# EAGLE board MEGA2560_Rev3e (EAGLE 9.3.0)
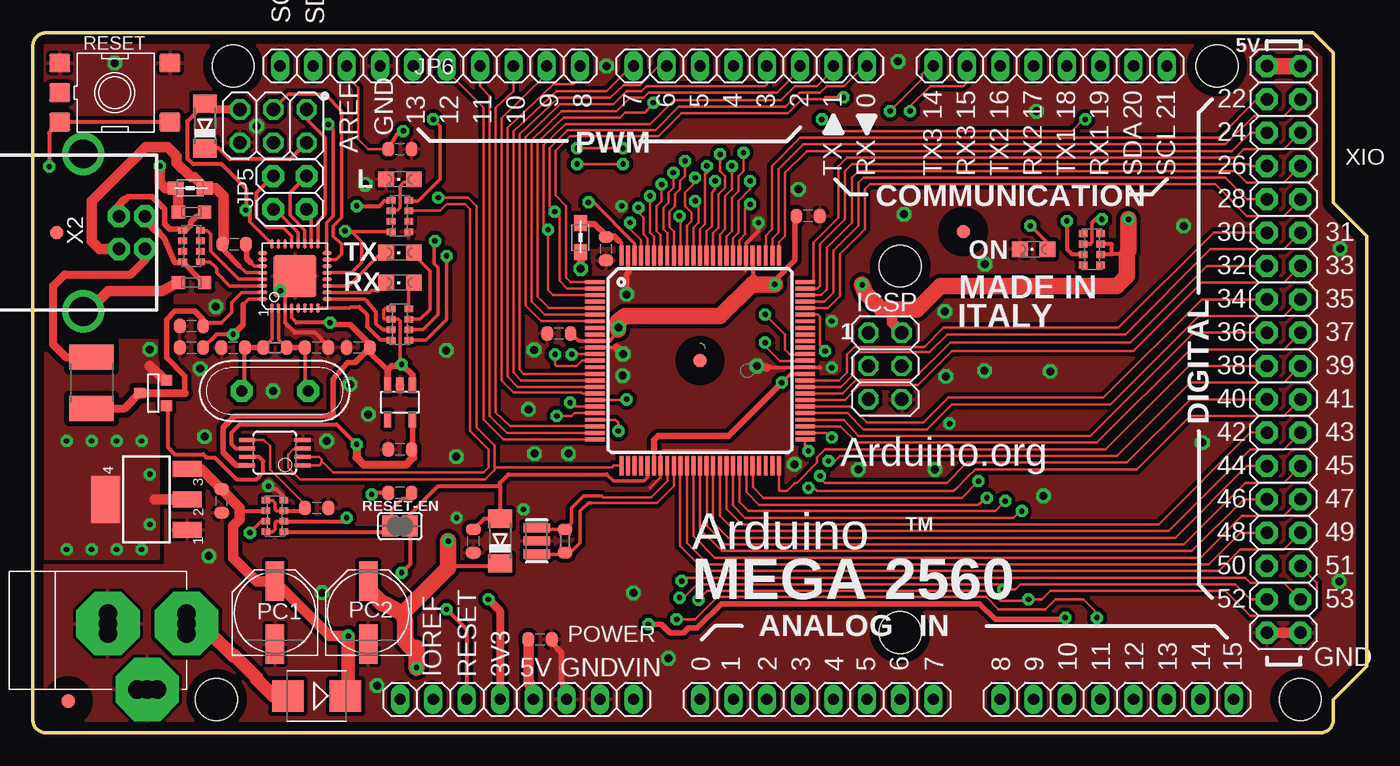
[diagram p2: board, top side]
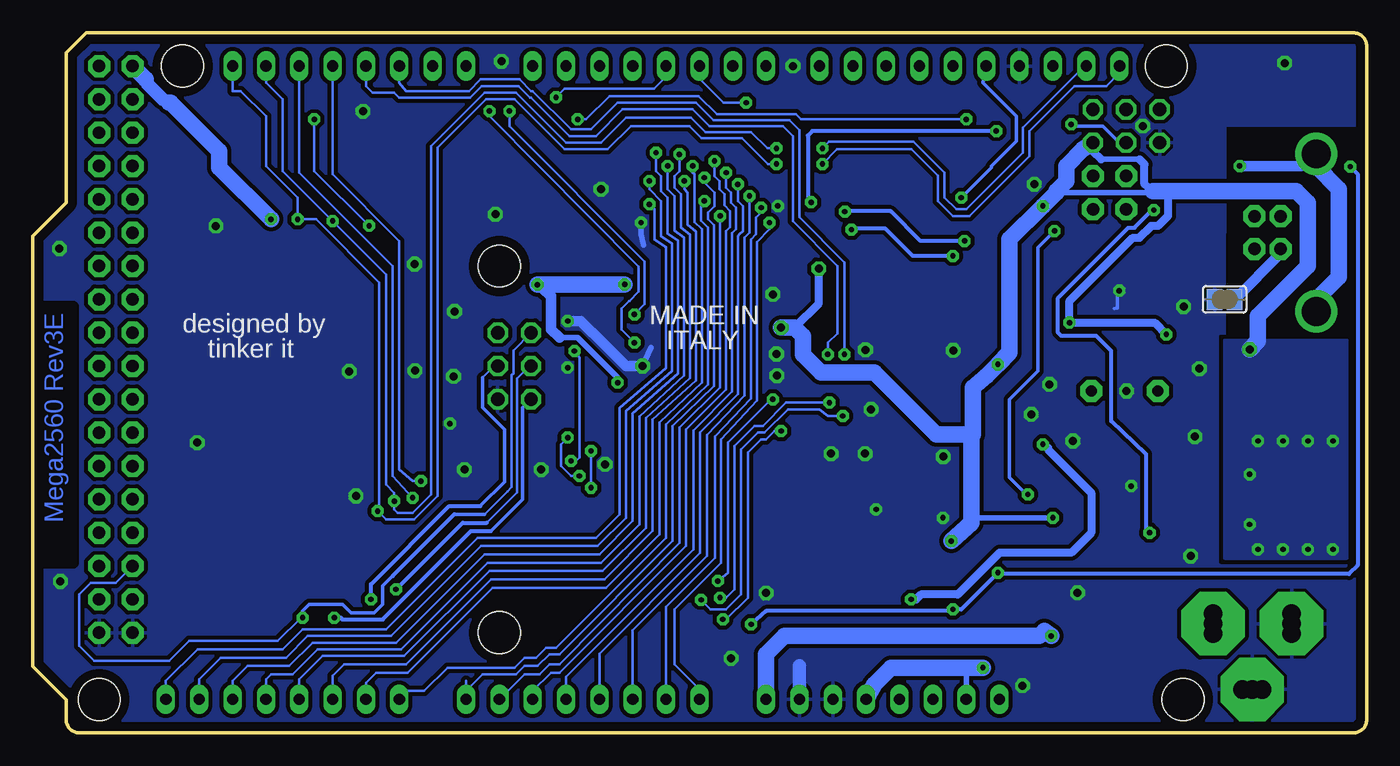
[diagram p3: board, bottom side, seen from below]

Size 101.6 x 53.34 mm. Coordinates in mm from the lower left corner, seen from the top.
Outline: 97.54,53.34 99.06,51.82 99.06,40.39 101.6,37.85 101.6,5.08 99.06,2.54 99.06,1 arc-90 98.06,0 1,0 arc-90 0,1 0,52.34 arc-90 1,53.34 97.54,53.34
Copper layers (1*16): Top 0.035mm / dielectric 1.5mm / Bottom 0.035mm
Design rules "ArduinoMega *": minimum track width 8mil, minimum drill 16mil, track to track 7mil, track to pad 7mil, pad to pad 8mil, via to via 10mil, smd to smd 7mil, copper to edge 27mil, drill to drill 12mil, minimum pad ring 10mil, minimum via ring 10mil, stop-mask expansion 2mil, vias tented up to drill 24mil, thermal gap 10mil
Net classes: 0 default: width 0.203 mm, drill 0.406 mm, clearance 0.203 mm; 1 power: width 0.61 mm, drill 0.406 mm, clearance 0.203 mm; 2 gnd: width 0.305 mm, drill 0.406 mm, clearance 0.203 mm; 3 power usb: width 0.508 mm, drill 0.406 mm, clearance 0.203 mm
Holes 3.2 mm at 96.55,2.55 15.27,50.81 90.2,50.81 14,2.55 66.07,35.57 66.07,7.63
tRestrict: area 42.5,37.2 to 42.9,37.4
bRestrict: 3 lines

## Footprints (pad centres in the part's own frame; a part is rotated, then mirrored left to right if it is on the bottom)
1X08 = drill 0.85 pad 1.422 long: 1 -8.89,0; 2 -6.35,0; 3 -3.81,0; 4 -1.27,0; 5 1.27,0; 6 3.81,0; 7 6.35,0; 8 8.89,0
C0603-ROUND = smd 0.898 x 1.1: 1 -0.889,0; 2 0.889,0
SMB = smd 2.4 x 2.4: A 2.2,0; C -2.2,0
MINIMELF = smd 1.4 x 1.8: A 1.7,0; C -1.7,0
L1812 = smd 1.9 x 3.4: 1 -1.95,0; 2 1.95,0
FIDUCIA-MOUNT = smd 1.016 x 1.016: P$1 0,0
SJ = smd 1.168 x 1.6: 1 -0.762,0; 2 0.762,0
LINEAR_SOT223 = smd 1.219 x 2.235: 1 -2.311,-3.099; 2 0,-3.099; 3 2.311,-3.099 | smd 3.6 x 2.2: 4 0,3.099
TQFP100 = smd 1.5 x 0.3: 1 -8,6; 2 -8,5.5; 3 -8,5; 4 -8,4.5; 5 -8,4; 6 -8,3.5; 7 -8,3; 8 -8,2.5; 9 -8,2; 10 -8,1.5; 11 -8,1; 12 -8,0.5; 13 -8,0; 14 -8,-0.5; 15 -8,-1; 16 -8,-1.5; 17 -8,-2; 18 -8,-2.5; 19 -8,-3; 20 -8,-3.5; 21 -8,-4; 22 -8,-4.5; 23 -8,-5; 24 -8,-5.5; 25 -8,-6; 51 8,-6; 52 8,-5.5; 53 8,-5; 54 8,-4.5; 55 8,-4; 56 8,-3.5; 57 8,-3; 58 8,-2.5; 59 8,-2; 60 8,-1.5; 61 8,-1; 62 8,-0.5; 63 8,0; 64 8,0.5; 65 8,1; 66 8,1.5; 67 8,2; 68 8,2.5; 69 8,3; 70 8,3.5; 71 8,4; 72 8,4.5; 73 8,5; 74 8,5.5; 75 8,6 | smd 0.3 x 1.5: 26 -6,-8; 27 -5.5,-8; 28 -5,-8; 29 -4.5,-8; 30 -4,-8; 31 -3.5,-8; 32 -3,-8; 33 -2.5,-8; 34 -2,-8; 35 -1.5,-8; 36 -1,-8; 37 -0.5,-8; 38 0,-8; 39 0.5,-8; 40 1,-8; 41 1.5,-8; 42 2,-8; 43 2.5,-8; 44 3,-8; 45 3.5,-8; 46 4,-8; 47 4.5,-8; 48 5,-8; 49 5.5,-8; 50 6,-8; 76 6,8; 77 5.5,8; 78 5,8; 79 4.5,8; 80 4,8; 81 3.5,8; 82 3,8; 83 2.5,8; 84 2,8; 85 1.5,8; 86 1,8; 87 0.5,8; 88 0,8; 89 -0.5,8; 90 -1,8; 91 -1.5,8; 92 -2,8; 93 -2.5,8; 94 -3,8; 95 -3.5,8; 96 -4,8; 97 -4.5,8; 98 -5,8; 99 -5.5,8; 100 -6,8
MLF32 = smd 0.7 x 0.28: 1 -2.45,1.75; 2 -2.45,1.25; 3 -2.45,0.75; 4 -2.45,0.25; 5 -2.45,-0.25; 6 -2.45,-0.75; 7 -2.45,-1.25; 8 -2.45,-1.75; 17 2.45,-1.75; 18 2.45,-1.25; 19 2.45,-0.75; 20 2.45,-0.25; 21 2.45,0.25; 22 2.45,0.75; 23 2.45,1.25; 24 2.45,1.75 | smd 0.28 x 0.7: 9 -1.75,-2.45; 10 -1.25,-2.45; 11 -0.75,-2.45; 12 -0.25,-2.45; 13 0.25,-2.45; 14 0.75,-2.45; 15 1.25,-2.45; 16 1.75,-2.45; 25 1.75,2.45; 26 1.25,2.45; 27 0.75,2.45; 28 0.25,2.45; 29 -0.25,2.45; 30 -0.75,2.45; 31 -1.25,2.45; 32 -1.75,2.45 | smd 3.254 x 3.254: 33 0,0
SOT23-DBV = smd 0.55 x 1.2: 1 -0.95,-1.3; 2 0,-1.3; 3 0.95,-1.3; 4 0.95,1.3; 5 -0.95,1.3
MSOP08 = smd 0.3 x 1.2: 1 -0.976,-2.113; 2 -0.326,-2.113; 3 0.324,-2.113; 4 0.974,-2.113; 5 0.974,2.112; 6 0.324,2.112; 7 -0.326,2.112; 8 -0.976,2.112
2X03 = drill 1.016 pad 1.55 octagon: 1 -2.54,-1.27; 2 -2.54,1.27; 3 0,-1.27; 4 0,1.27; 5 2.54,-1.27; 6 2.54,1.27
2X02 = drill 0.95 pad 1.676 octagon: 1 -1.27,-1.27; 2 -1.27,1.27; 3 1.27,-1.27; 4 1.27,1.27
1X10 = drill 0.85 pad 1.422 long: 1 -11.43,0; 2 -8.89,0; 3 -6.35,0; 4 -3.81,0; 5 -1.27,0; 6 1.27,0; 7 3.81,0; 8 6.35,0; 9 8.89,0; 10 11.43,0
CHIPLED_0805 = smd 1.2 x 1.2: A 0,-1.05; C 0,1.05
0805 = smd 1.2 x 1: 1 -1.1,0; 2 1.1,0
PANASONIC_D = smd 3 x 1.4: + 2.4,0; - -2.4,0
R0603-ROUND = smd 0.898 x 1.1: 1 -0.889,0; 2 0.889,0
TS42 = smd 1.6 x 1.4: 1 -4.2,2.25; 2 4.2,2.25; 3 -4.2,-2.25; 4 4.2,-2.25; 5 -4.2,0
CAY16 = smd 0.5 x 0.65: 1 -1.2,-0.675; 2 -0.4,-0.675; 3 0.4,-0.675; 4 1.2,-0.675; 5 1.2,0.675; 6 0.4,0.675; 7 -0.4,0.675; 8 -1.2,0.675
SOT-23 = smd 0.787 x 0.889: 1 0.025,-1.016; 2 -0.94,1.016; 3 0.991,1.016
POWERSUPPLY_DC-21MM = drill 1.4 pad 4.826 octagon: 1 -5.08,-3.353; 2 -0.076,-6.35; 3 -0.076,-0.356 | drill 1.4: 4 -5.08,-4.115; 5 -5.08,-2.591; 6 -0.838,-0.356; 7 0.686,-0.356; 8 -0.838,-6.35; 9 0.686,-6.35
PN61729 = drill 0.95 pad 1.676 octagon: 1 1.25,4.71; 2 -1.25,4.71; 3 -1.25,2.71; 4 1.25,2.71 | drill 2.2: P$1 -6,0; P$2 6,0
2X18 = drill 0.95 pad 1.676 octagon: 1 -21.59,-1.27; 2 -21.59,1.27; 3 -19.05,-1.27; 4 -19.05,1.27; 5 -16.51,-1.27; 6 -16.51,1.27; 7 -13.97,-1.27; 8 -13.97,1.27; 9 -11.43,-1.27; 10 -11.43,1.27; 11 -8.89,-1.27; 12 -8.89,1.27; 13 -6.35,-1.27; 14 -6.35,1.27; 15 -3.81,-1.27; 16 -3.81,1.27; 17 -1.27,-1.27; 18 -1.27,1.27; 19 1.27,-1.27; 20 1.27,1.27; 21 3.81,-1.27; 22 3.81,1.27; 23 6.35,-1.27; 24 6.35,1.27; 25 8.89,-1.27; 26 8.89,1.27; 27 11.43,-1.27; 28 11.43,1.27; 29 13.97,-1.27; 30 13.97,1.27; 31 16.51,-1.27; 32 16.51,1.27; 33 19.05,-1.27; 34 19.05,1.27; 35 21.59,-1.27; 36 21.59,1.27
RESONATOR = smd 0.7 x 2: 1 -1,0; 2 0,0; 3 1,0
QS = drill 0.85 pad 1.676 octagon: 1 -2.54,0; 2 2.54,0
CT/CN0603 = smd 1 x 1: 1 -1,0; 2 1,0

## Placement (x,y rotation side)
ADCH  FH254-108DF08500V  [1X08]  82.58,2.55 0 top
ADCL  FH254-108DF08500V  [1X08]  59.72,2.55 0 top
C1  22p  [C0603-ROUND]  33.55,14.62 270 top
C2  100nF  [C0603-ROUND]  14.38,17.67 270 top
C3  100nF  [C0603-ROUND]  27.97,44.46 0 top
C4  100nF  [C0603-ROUND]  38.63,7.12 0 top
C5  100nF  [C0603-ROUND]  59.06,39.38 0 top
C6  100nF  [C0603-ROUND]  40.07,30.43 180 top
C7  100nF  [C0603-ROUND]  27.97,18.3 0 top
C8  100nF  [C0603-ROUND]  12.09,31 180 top
C9  100nF  [C0603-ROUND]  12.09,29.35 180 top
C10  1uF  [C0603-ROUND]  15.34,37.22 180 top
C11  100nF  [C0603-ROUND]  24.79,29.35 0 top
C12  100nF  [C0603-ROUND]  21.62,17.16 180 top
C13  1uF  [C0603-ROUND]  27.97,21.6 0 top
C14  22p  [C0603-ROUND]  15.27,29.35 180 top
C15  22p  [C0603-ROUND]  21.62,29.35 0 top
C16  100nF  [C0603-ROUND]  43.66,36.88 270 top
COMMUNICATION  FH254-108DF08500V  [1X08]  77.5,50.81 180 top
D1  M7  [SMB]  21.62,2.81 180 top
D2  CD1206-S01575  [MINIMELF]  13.11,46.24 90 top
D3  CD1206-S01575  [MINIMELF]  35.59,14.62 90 top
F1  MF-MSMF050-2 500mA  [L1812]  4.47,26.68 90 top
FD1  FIDUCIALMOUNT  [FIDUCIA-MOUNT]  70.87,38.2 0 top
FD2  FIDUCIALMOUNT  [FIDUCIA-MOUNT]  2.69,2.43 0 top
FD3  FIDUCIALMOUNT  [FIDUCIA-MOUNT]  1.8,38.11 0 top
FD4  FIDUCIALMOUNT  [FIDUCIA-MOUNT]  50.83,28.36 0 top
GROUND  [SJ]  10.82,33.03 180 bottom
IC1  1870_LD1117S50CTR  [LINEAR_SOT223]  8.66,17.79 90 top
IC3  ATMEGA2560-15AU  [TQFP100]  50.83,28.36 0 top
IC4  ATMEGA16U2-MU  [MLF32]  19.96,34.81 90 top
IC6  LP2985-33DBVR  [SOT23-DBV]  27.97,25.18 180 top
IC7  LMV358IDGKR  [MSOP08]  18.44,21.35 90 top
ICSP  ICSP  [2X03]  64.92,27.95 270 top
ICSP1  ICSP  [2X03]  18.31,46.24 180 top
JP5  2x2M - NM  [2X02]  19.58,41.16 90 top
JP6  FH254-110DF08500V  [1X10]  30.25,50.81 0 top
L  Yellow  [CHIPLED_0805]  27.97,42.18 90 top
L1  MH2029-300Y  [0805]  11.99,41.52 180 top
L2  10uH  [0805]  41.71,37.74 270 top
ON  Green  [CHIPLED_0805]  76.23,36.84 90 top
PC1  47uF  [PANASONIC_D]  18.44,9.16 90 top
PC2  47uF  [PANASONIC_D]  25.55,9.16 90 top
POWER  FH254-108DF08500V  [1X08]  36.86,2.55 0 top
PWML  FH254-108DF08500V  [1X08]  54.64,50.81 180 top
R1  1M  [R0603-ROUND]  40.54,14.62 90 top
R2  1M  [R0603-ROUND]  18.44,29.35 0 top
RESET  TS42  [TS42]  6.25,48.78 0 top
RESET-EN  [SJ]  27.97,15.76 0 top
RN1  10k  [CAY16]  80.67,36.84 270 top
RN2  22R  [CAY16]  12.09,37.1 90 top
RN3  1K  [CAY16]  27.97,39.38 270 top
RN4  1K  [CAY16]  27.97,31.13 90 top
RN5  10k  [CAY16]  18.44,16.52 90 top
RX  Yellow  [CHIPLED_0805]  27.97,34.3 90 top
T1  PMV48XP  [SOT-23]  9.17,25.92 270 top
TX  Yellow  [CHIPLED_0805]  27.97,36.59 90 top
U$1  DNP  [FRAME]  0.03,0.01 0 top
U$2  DNP  [FRAME]  0.03,0.01 0 top
X1  POWERSUPPLY_DC21MMX  [POWERSUPPLY_DC-21MM]  5.36,8.39 90 top
X2  [PN61729]  3.84,38.11 270 top
XIO  18x2F-H8.5  [2X18]  95.28,29.22 270 top
Y1  CSTCE16M0V53-R0  [RESONATOR]  38.38,14.62 270 top
Y2  16MHz  [QS]  18.44,26.05 180 top
Z1  BRNCG0603MLC-05E  [CT/CN0603]  12.09,34.3 0 top
Z2  BRNCG0603MLC-05E  [CT/CN0603]  12.09,39.69 0 top

## Tracks (layer width: path | path; a pad name or v marks a point on that pad's centre or on a via)
8PB4
  Top 0.254: 20.6,39.89 JP5.1 21.21,39.53 IC4.18
8PB5
  Top 0.254: 19.58,41.16 19.58,39.43 20.71,38.3 IC4.19
  Top 0.305: 19.58,41.16 JP5.3
8PB6
  Top 0.254: IC4.20 20.21,38.12 18.44,39.89 JP5.2
8PB7
  Top 0.254: IC4.21 19.71,37.86 19.08,38.49 17.81,38.49 17.04,39.26 17.04,39.38
  Top 0.305: 17.04,39.38 17.04,41.16 JP5.4
+3V3  (via drill 0.41)
  Top 0.305: IC7.6 15.45,21.67 15.14,21.98 15.14,22.87 15.77,23.51 23.14,23.51 v24.66,21.98
  Top 0.406: 28.92,21.63 IC6.5
  Top 0.61: POWER.4 35.59,9.28 v34.7,10.17 | 28.92,21.63 C13.2 28.98,21.56 28.98,20.97 28.47,20.46 25.17,20.46 24.66,20.97 v24.66,21.98
  Bottom 0.61: v34.7,10.17 34.32,10.17 33.93,10.55 31.14,10.55 27.97,13.73 22.5,13.73 20.98,15.25 20.98,18.3 24.28,21.6 24.28,21.73 v24.66,21.98
+5V  (via drill 0.41, 0.61)
  Top 0.254: IC3.80 54.84,36.31 54.81,36.28 54.84,36.26 54.84,35.42 | 57.68,27.32 57.72,27.36 | v28.09,28.08 28.03,28.21 27.97,28.65 27.97,31.38 27.82,31.53 RN4.6 26.81,31.53 26.73,31.61 26.73,32.21 26.84,32.33 RN4.5 | RN5.8 18.26,15.32 18.44,15.51 18.44,16.01 18.55,16.12 RN5.2 | IC4.32 16.44,33.06 16.03,32.65
  Top 0.279: 57.72,27.36 IC3.61 | v57.05,26.68 57.68,27.32 | 44.48,30.49 43.97,29.86 IC3.10 41.62,29.86 | IC4.4 19.71,31.63 20.09,31.25 | IC3.31 47.33,21.53
  Top 0.305: 54.89,34.68 54.89,35.12 54.84,35.17 54.84,35.42 | 83.34,36.46 82.19,36.46 | v24.66,40.14 26.44,40.14 26.76,40.53 RN3.1 | RN1.6 82.18,36.44 82.19,36.46 | 82.19,36.46 82.19,37.22 82.18,37.24 RN1.7 | 41.62,29.86 C6.1 | C9.1 14,30.37 v15.27,30.37 | RN5.2 23.63,16.12 v23.9,16.4 | v22.63,31.25 20.09,31.25 | D2.C 14.17,44.54 15.01,43.7 19.58,43.7 ICSP1.2 | D3.C 35.03,12.92 34.82,12.71 32.66,12.71 31.7,12.71 31.95,12.92 31.65,13.22
  Top 0.406: 44.57,30.72 44.48,30.49 v44.6,30.87 | v56.52,34.18 56.52,34.4 56.54,34.48 58.06,36.03 58.06,39.28 C5.1 | C11.2 25.55,29.1 27.02,27.64 | C11.2 25.68,29.6 24.16,31.13 22.76,31.13 v22.63,31.25 | C11.2 24.54,28.21 23.99,28.21 22.89,26.98 22.89,24.27 22.63,24.14 15.39,24.14 14.5,23.25 14.5,21.35 15.49,20.36 16.34,20.36 IC7.8 | 16.03,32.65 16.03,31.13 v15.27,30.37
  Top 0.508: v57.05,26.68 52.98,22.62 47.63,22.62 47.32,22.31 47.32,21.53 47.33,21.53 | 26.99,26.68 IC6.3 27.02,27.64 27.33,27.95 27.97,27.95 | IC6.1 28.92,27.26 v28.09,28.08
  Top 0.61: v28.09,28.08 27.97,27.95 | 54.89,34.68 54.89,34.3 55.02,34.18 | L2.2 41.71,35.34 v41.73,35.37
  Top 0.813: 9.3,17.79 IC1.2 | C4.1 37.74,3.95 POWER.5 | 83.34,34.81 83.34,34.94 | 65.43,32.27 65.43,31.25 ICSP.2 | T1.2 10.13,26.86 8.92,27.95
  Top 1.27: XIO.1 XIO.2 | v63.17,34.15 63.4,33.54 64.67,32.27 65.43,32.27 67.34,32.27 69.11,34.05 82.58,34.05 83.34,34.81 | 83.34,34.94 83.34,36.46 83.46,36.72 v83.46,39.13 | 44.57,30.72 44.57,31.35 45.11,31.76 52.35,31.76 54.76,34.18 55.02,34.18 v56.52,34.18 | v31.65,14.62 31.65,13.22 31.65,12.59 28.16,9.09 | v29.24,4.97 29.24,6.49 28.85,6.49 28.35,7 28.35,8.52 28.16,9.09 | PC2.+ 25.55,10.93 26.57,9.92 27.08,9.66 28.16,9.09
  Bottom 0.406: v44.6,30.87 44.6,30.75 | 61.49,30.11 60.1,30.11 57.05,27.06 v57.05,26.68 | 23.52,41.16 16.79,41.16 16.66,41.29 16.28,41.29 | 17.3,43.7 20.22,43.7 | v23.9,16.4 30.12,16.4 | POWER.2 30.51,4.76 30.71,4.97
  Bottom 0.61: 63.14,34.18 v63.17,34.15 | 23.65,41.29 23.52,41.16 | 16.28,41.29 16.92,41.8 16.92,43.32 17.3,43.7 | 20.22,43.7 20.85,44.34 ICSP1.2 | v15.27,30.37 16.15,31.25 v22.63,31.25 22.63,32.91 17.81,37.73 17.3,37.73 16.41,38.62 15.9,38.62 15.14,39.38 15.14,41.29 | 43.59,30.87 41.73,32.73 v41.73,35.37
  Bottom 0.813: 61.49,30.11 62.13,30.75 62.13,33.29 v63.17,34.15
  Bottom 1.016: 91.21,48.02 91.72,48.27 92.86,49.42 92.99,49.8
  Bottom 1.27: v29.24,4.97 30.71,4.97 36.22,4.97 37.49,3.7 POWER.5 | v56.52,34.18 63.14,34.18 | v44.6,30.87 43.59,30.87 42.95,30.24 42.95,28.84 41.55,27.44 37.49,27.44 32.79,22.75 30.12,22.75 | ICSP1.2 20.98,44.84 21.62,44.46 22.89,43.19 22.89,42.05 23.65,41.29 23.65,41.16 v24.66,40.14 27.2,37.6 27.2,28.97 v28.09,28.08 28.98,27.19 30,26.3 30,22.75 30.12,22.75 | 30.12,22.75 30.12,16.4 30.12,16.01 v31.65,14.62 | v83.46,39.13 87.4,43.07 87.4,44.34 91.08,48.02 91.21,48.02 | v8.92,29.22 8.28,29.86 8.28,31.76 4.47,35.57 4.47,40.4 5.36,41.29 15.14,41.29 16.28,41.29 | 92.99,49.8 XIO.1
  other vias: 6.38,22.24 4.47,22.24 8.28,22.24 2.57,22.24 8.92,19.7 2.57,13.98 6.38,13.98 4.47,13.98 8.92,15.89 8.28,13.98
  pour Top (isolate 0.406, no thermals): 9.55,13.35 9.55,29.86 0.66,29.86 0.66,13.35
  pour Bottom: 1.5,13.35 1.5,29.86 10.82,29.86 10.82,13.35
ADC0  (via drill 0.41)
  Top 0.203: IC3.97 46.33,37.53 45.49,38.37 v45.49,38.87
  Bottom 0.203: ADCL.1 50.83,3.31 52.73,5.22 52.73,9.41 49.17,12.97 49.17,22.36 46.43,25.34 46.43,37.4 45.49,38.37 v45.49,38.87
ADC1  (via drill 0.41)
  Top 0.203: IC3.96 46.83,37.67 46.51,37.99 46.51,39.26 46.13,39.64 v46.13,40.02
  Bottom 0.203: ADCL.2 53.37,9.61 49.66,13.32 49.66,22.57 46.91,25.46 46.91,37.58 46.51,37.99 46.51,39.26 46.13,39.64 v46.13,40.02
ADC2  (via drill 0.41)
  Top 0.203: v47.02,40.91 47.02,38.11 47.32,37.81 IC3.95 47.29,36.36
  Bottom 0.203: ADCL.3 55.91,7.81 50.24,13.47 50.24,22.69 47.4,25.69 47.4,37.73 47.02,38.11 v47.02,40.91
ADC3  (via drill 0.41)
  Top 0.203: IC3.94 47.83,37.94 47.52,38.24 47.52,40.14 47.9,40.53 v47.9,41.8
  Bottom 0.203: ADCL.4 58.45,2.76 58.55,2.86 58.55,3.06 58.45,3.16 58.45,6.03 50.77,13.7 50.77,22.87 47.88,25.82 47.88,37.86 47.78,37.99 47.52,38.24 47.52,40.14 47.9,40.53 v47.9,41.8
ADC4  (via drill 0.41)
  Top 0.203: IC3.93 48.33,38.07 48.03,38.37 48.03,40.02 48.41,40.4 48.41,41.16 48.79,41.54 v48.79,42.68
  Bottom 0.203: 60.99,2.45 ADCL.5 60.99,4.28 51.28,13.98 51.28,23.02 48.34,26.02 48.34,38.06 48.03,38.37 48.03,40.02 48.41,40.4 48.41,41.16 48.79,41.54 v48.79,42.68
ADC5  (via drill 0.41)
  Top 0.203: IC3.92 48.83,38.21 48.49,38.54 48.49,39.71 48.92,40.14 48.92,41.03 49.3,41.41 49.3,42.05 49.68,42.43 v49.68,43.57
  Bottom 0.203: v49.68,43.57 49.68,42.43 49.3,42.05 49.3,41.41 48.92,41.03 48.92,40.2 48.49,39.76 48.49,38.54 48.79,38.24 48.79,26.17 51.84,23.13 51.84,14.24 61.49,4.58 62.13,4.58 63.53,3.19 ADCL.6
ADC6  (via drill 0.41)
  Top 0.203: IC3.91 49.33,39.36 v49.25,39.38
  Bottom 0.203: v49.25,39.38 49.25,26.3 52.35,23.25 52.35,14.49 61.49,5.22 62.26,5.22 63.02,4.46 64.16,4.46 ADCL.7
ADC7  (via drill 0.41)
  Top 0.203: IC3.90 49.83,38.64 50.19,39 50.19,39.64 49.68,40.14 49.68,41.16 50.44,41.92 v50.44,42.3
  Bottom 0.203: v50.44,42.3 50.44,41.92 49.68,41.16 49.68,40.14 50.19,39.64 50.19,39.15 49.71,38.67 49.71,26.43 52.86,23.38 52.86,14.62 61.49,5.98 62.26,5.98 63.14,5.09 64.16,5.09 64.8,4.46 67.34,4.46 68.61,3.19 | 68.61,3.19 ADCL.8 | 68.61,3.19 68.61,3.95
ADC8  (via drill 0.41)
  Top 0.203: IC3.89 50.33,38.5 50.7,38.87 50.7,40.27 v50.44,40.53
  Bottom 0.203: v50.44,40.53 50.7,40.27 50.7,39.03 50.17,38.49 50.17,26.56 53.37,23.51 53.37,14.87 61.75,6.49 62.51,6.49 63.27,5.73 64.16,5.73 64.92,4.97 70,4.97 71.78,3.19 73.69,3.19 ADCH.1
ADC9  (via drill 0.41)
  Top 0.203: IC3.88 50.83,38.37 51.21,38.75 51.21,42.56 51.33,42.68 v51.33,43.19
  Bottom 0.203: v51.33,43.19 51.33,42.68 51.21,42.56 51.21,38.9 50.62,38.37 50.62,26.68 53.87,23.63 53.87,15.13 57.94,11.06 66.57,11.06 73.05,4.58 75.46,4.58 76.23,3.82 ADCH.2
ADC10  (via drill 0.41)
  Top 0.203: IC3.87 51.33,38.23 51.71,38.62 51.71,41.16 51.97,41.41 v51.97,42.05
  Bottom 0.203: v51.97,42.05 51.97,41.41 51.71,41.16 51.71,38.72 51.08,38.19 51.08,26.86 54.38,23.86 54.38,15.38 58.06,11.7 66.7,11.7 73.18,5.22 77.88,5.22 78.77,4.33 ADCH.3
ADC11  (via drill 0.41)
  Top 0.203: IC3.86 51.83,38.1 52.22,38.49 52.22,41.03 52.73,41.54 52.73,42.43 52.35,42.81 v52.35,44.08
  Bottom 0.203: v52.35,44.08 52.35,42.81 52.73,42.43 52.73,41.54 52.22,41.03 52.22,38.49 51.54,37.96 51.54,27.04 54.89,23.99 54.89,15.63 58.19,12.33 66.83,12.33 73.3,5.85 79.53,5.85 81.31,4.08 ADCH.4
ADC12  (via drill 0.41)
  Top 0.203: IC3.85 52.33,37.96 52.73,38.37 52.73,40.91 53.24,41.41 v53.24,43.19
  Bottom 0.203: v53.24,43.19 53.24,41.41 52.73,40.91 52.73,38.26 51.99,37.73 51.99,27.22 55.4,24.12 55.4,15.89 58.32,12.97 66.95,12.97 73.56,6.36 79.91,6.36 81.81,4.46 83.46,4.46 83.85,4.08 ADCH.5
ADC13  (via drill 0.41)
  Top 0.203: IC3.84 52.83,37.83 53.24,38.24 53.24,40.78 53.75,41.29 53.75,42.43 54.13,42.81 v54.13,44.21
  Bottom 0.203: v54.13,44.21 54.13,42.81 53.75,42.43 53.75,41.29 53.24,40.78 53.24,38.04 52.45,37.5 52.45,27.39 55.91,24.35 55.91,16.14 58.45,13.6 67.21,13.6 73.94,6.87 80.29,6.87 82.07,5.09 85.24,5.09 86.39,3.95 ADCH.6
ADC14  (via drill 0.41)
  Top 0.203: IC3.83 53.33,37.69 53.75,38.11 53.75,40.53 54.64,41.41 v54.64,42.05
  Bottom 0.203: v54.64,42.05 54.64,41.41 53.75,40.53 53.75,37.86 52.91,37.27 52.91,27.57 56.41,24.52 56.41,16.4 58.57,14.24 67.46,14.24 74.32,7.38 80.67,7.38 82.32,5.73 87.27,5.73 88.93,4.08 ADCH.7
ADC15  (via drill 0.41)
  Top 0.203: IC3.82 53.83,37.56 54.25,37.99 54.25,39.89 v54.64,40.27
  Bottom 0.203: v54.64,40.27 54.25,39.89 54.25,37.58 53.37,36.99 53.37,27.8 56.92,24.75 56.92,16.65 58.7,14.87 67.72,14.87 74.7,7.89 81.05,7.89 82.58,6.36 89.05,6.36 91.47,3.95 ADCH.8
AREF  (via drill 0.41)
  Top 0.203: C3.1 25.55,44.46 24.79,45.22 24.79,49.16 23.9,50.05 JP6.3
  Top 0.254: IC3.98 45.83,37.3 42.7,40.42 v42.32,40.42
  Top 0.305: v28.22,45.86 27.75,45.61 C3.1
  Bottom 0.305: v42.32,40.42 42.57,40.7 42.57,45.5 42.21,45.86 v28.22,45.86
AVCC
  Top 0.279: IC3.100 44.83,37.31
  Top 0.305: 44.83,37.31 44.63,37.5
  Top 0.508: 44.63,37.5 44.32,37.81 43.7,37.81 C16.1 43.66,37.91 42.8,38.77 41.94,38.77 L2.1
CMP
  Top 0.203: C12.2 20.73,17.41 18.06,20.08 18.06,21.86 17.59,22.32 IC7.5
  Top 0.254: 19.1,16.9 18.57,16.9 18.44,17.03 18.44,17.54 18.26,17.72 RN5.5
  Top 0.305: 19.1,16.9 RN5.3 | RN5.3 19.9,16.92 | C12.2 20.49,16.92 RN5.3
D+
  Top 0.406: 7.01,40.65 7.23,40.87 9.08,40.87 10.06,39.89 10.06,38.75 10.44,38.37 11.35,38.37 RN2.5 11.64,38.3 12.04,38.7 12.04,38.93 12.47,39.36 12.76,39.36 Z2.2 12.96,39.51
  Top 0.61: X2.3 6.55,40.19 7.01,40.65
D-
  Top 0.406: 9.55,38.11 9.59,38.11 10.06,37.64 10.06,37.6 10.82,35.83 11.35,35.83 RN2.8 12.76,34.56 Z1.2
  Top 0.61: X2.2 8.55,39.11 9.55,38.11
DTR  (via drill 0.41)
  Top 0.254: 24.28,38.18 23.83,38.18 v23.77,38.24 | 24.28,38.18 RN3.4 | IC4.13 24.28,35.06 25.04,35.83 25.04,37.42 24.28,38.18
  Top 0.305: C7.1 26.06,18.3 v25.81,18.17
  Bottom 0.254: v25.81,18.17 25.93,18.17 27.2,19.44 27.2,25.41 25.04,27.57 25.04,36.97 v23.77,38.24
GATE_CMD
  Top 0.305: T1.3 10.31,24.8 10.31,21.73 10.82,21.22 12.98,21.22 13.23,20.97 13.87,20.97 15.52,19.32 17.04,19.32 17.55,19.82 17.55,20.71 17.24,21.02 IC7.7
  Top 0.406: T1.3 10.19,24.65
GND  (via drill 0.41, 0.61)
  Top 0.203: 54.25,35.19 54.33,35.26 IC3.81 54.36,36.36 | 54.33,37.29 54.33,36.39 54.36,36.36 | IC3.32 47.83,21.25 48.06,21.53 52.91,21.53 | IC3.32 | IC3.32 47.83,19.49 47.02,18.68 | 54.36,36.36 54.28,36.39
  Top 0.279: 45.33,35.22 IC3.99 | 58.85,27.85 58.84,27.86 IC3.62 58.83,27.85 | 56.11,27.85 58.83,27.85 | 58.83,27.85 59.94,27.85 | 19.21,31.24 IC4.3 | 19.21,33.34 19.21,33.37 19.22,33.38 19.22,32.31 | 42.88,29.36 | 42.88,29.36 44.35,29.36 | IC3.11 42.88,29.36
  Top 0.305: IC1.1 11.84,15.51 | 45.42,35.12 45.33,35.22 | 44.42,29.37 44.35,29.36 44.37,29.37 44.45,29.37 | 56.11,27.85 56.08,27.88 | 54.33,37.29 55.27,38.24 v55.27,38.87 | 59.94,27.85 59.97,27.83 | v18.85,33.69 19.26,33.69 | C15.2 22.5,29.48 21.49,30.49 19.96,30.49 19.21,31.24 | IC4.33 19.96,33.34 v18.85,33.69 | v18.85,33.69 19.21,33.33 | 19.21,33.34 v18.85,33.69 | RN5.4 19.12,18.01 18.57,18.55 18.19,18.55 v17.93,18.81
  Top 0.406: C4.2 39.9,6.49 40.28,6.11 40.28,3.95 POWER.6 | 56.08,27.88 56.03,27.83 v55.14,27.95 | v45.24,33.41 45.24,34.94 45.42,35.12
  Top 0.61: v55.14,27.95 55.91,27.83 | 44.45,29.37 v44.96,28.87
  Top 0.813: XIO.35 XIO.36
  Bottom 0.279: 19.21,32.34 19.23,32.34 18.97,32.37 18.97,33.39
  Bottom 0.305: GROUND.2 10.19,33.03
  Bottom 0.406: v44.96,28.87 45.11,29.1 | v55.27,38.87 55.27,37.99 55.07,37.17 | v55.14,27.95 54.51,29.35
  Bottom 0.813: v60.86,31.38 59.89,31.38 59,30.49 58.95,30.49 56.41,27.95 v55.14,27.95 | 93.75,7.89 XIO.35
  Bottom 1.016: POWER.7 43.21,5.09
  other vias: 68.72,20.06 38.2,21.27 31.5,29.15 38.18,29.19 87.66,38.62 89.08,22.11 72.52,35.73 22.02,10.68 13.41,13.47 32.28,16.4 40.79,21.27 17.04,46.24 25.55,24.27 58.32,41.41 76.45,47.36 44.86,40.14 44.93,27.22 48.41,5.68 26.21,3.59 13.08,22.57 24.16,26.56 25.32,41.8 60.86,27.83 58.01,20.46 12.75,27.75 37.74,24.65 77.5,27.55 76.99,18.05 99.58,36.89 69.82,23.56 72.49,27.6 18.29,26.05 69.48,32.11 62.87,20.06 99.5,11.54 65.91,51.17 43.7,50.81 13.94,32.47 66.37,39.51 69.55,27.17 37.36,17.03 32.26,21.04 22.38,22.24 45.75,10.66 6.25,51.04
  pour Top (isolate 0.305, rank 2): 0.36,52.72 101.63,52.72 101.63,0.65 0.66,0.65 0.66,29.86 10.82,29.86 10.77,45.91 0.3,45.91
  pour Bottom (isolate 0.305, rank 2): 0.66,52.72 101.63,52.72 102.26,52.08 102.26,0.65 1.3,0.65 0.66,1.28 0.66,29.86 10.82,29.86 10.77,46.27 0.61,46.27
L13
  Top 0.203: RN3.7 31.03,39.78 31.52,40.27 32.92,40.27 33.3,39.89 33.3,23 34.7,21.6 34.7,20.21 34.32,19.82 22.89,19.82 22,20.71 | IC7.2 21.81,21.02 22,20.84 22,20.71 | IC7.1 21.83,20.37 22,20.59 22,20.71
M8RXD
  Top 0.254: 27.27,30.75 RN4.7 | IC4.9 25.27,33.06 25.43,32.91
  Top 0.305: 27.27,30.75 26.7,30.75 26.11,31.2 26.11,32.09 25.43,32.91
M8TXD
  Top 0.254: 24.86,32.46 24.22,32.46 24.12,32.36 IC4.8
  Top 0.305: 24.86,32.46 25.45,31.86 25.45,30.97 26.44,29.98 27.23,29.98 RN4.8
MISO2
  Top 0.254: IC4.17 21.71,38.97 22.25,39.51 22.25,45.35 20.85,46.75 ICSP1.1
MOSI2  (via drill 0.41)
  Top 0.254: v22.5,46.37 22.89,45.99 22.89,39.38 22.38,38.87 22.38,36.72 22.41,36.63 IC4.16
  Bottom 0.254: ICSP1.4 18.82,44.97 20.09,46.24 22.25,46.24 22.38,46.37 v22.5,46.37
N$2
  Top 0.254: RN3.2 27.78,39.83 27.97,40.02 27.97,41.67 28.22,41.92 L.A
N$3  (via drill 0.41)
  Top 0.203: 77.24,37.1 ON.A | v80.16,46.75 80.04,46.75 79.15,45.86 60.99,45.86 v60.1,46.75
  Top 0.254: v30.51,46.75 31.01,46.24 31.01,42.18 29.36,40.53 28.91,40.53 RN3.8 | 77.24,37.1 77.24,37.38 v75.99,38.64
  Bottom 0.203: v75.99,38.64 80.16,42.81 v80.16,46.75 | v60.1,46.75 59.46,46.75 57.68,48.53 50.88,48.53 49.5,47.15 43.48,47.15 43.08,46.75 v30.51,46.75
N$54
  Top 0.254: RN4.4 28.64,33.83 RX.A
N$55
  Top 0.254: RN4.3 29.51,31.53 30.25,32.27 30.25,35.19 29.02,36.43 TX.A
PA0
  Top 0.203: IC3.78 55.83,37.91 56.29,38.37 56.29,43.19 58.45,45.35 90.32,45.35 93.24,48.27 XIO.3
PA1
  Top 0.203: IC3.77 56.33,37.64 56.79,38.11 56.79,42.94 58.7,44.84 90.83,44.84 92.99,47 95.28,47 XIO.4
PA2
  Top 0.203: XIO.5 92.74,45.73 91.34,44.34 58.95,44.34 57.3,42.68 57.3,37.86 56.83,37.38 IC3.76
PA3
  Top 0.203: XIO.6 95.28,44.46 92.23,44.46 91.59,43.83 62,43.83 61.37,43.19 61.37,39.27 59.46,37.37 59.46,34.53 59.44,34.36 IC3.75
PA4
  Top 0.203: IC3.74 59.78,33.86 59.97,34.05 59.97,37.24 61.87,39.14 61.87,42.81 62.38,43.32 92.61,43.32 92.74,43.19 XIO.7
PA5
  Top 0.203: IC3.73 60.04,33.36 60.48,33.79 60.48,36.99 62.38,38.89 62.38,42.3 62.89,42.81 91.59,42.81 92.48,41.92 95.28,41.92 XIO.8
PA6
  Top 0.203: IC3.72 60.3,32.86 60.99,33.54 60.99,36.73 62.89,38.64 62.89,41.92 63.27,42.3 90.83,42.3 92.48,40.65 XIO.9
PA7
  Top 0.203: IC3.71 60.57,32.36 61.49,33.29 61.49,36.48 63.4,38.38 63.4,41.41 63.78,41.8 90.07,41.8 92.48,39.38 95.28,39.38 XIO.10
PB0  (via drill 0.41)
  Top 0.203: IC3.19 45.42,25.36 v45.24,25.41 | v49.43,11.57 49.56,11.57 49.81,11.82 92.35,11.82 92.74,11.44 95.28,11.44 XIO.34
  Bottom 0.203: v45.24,25.41 45.36,25.41 48.67,22.11 48.67,12.2 v49.43,11.57
PB1  (via drill 0.41)
  Top 0.203: IC3.20 41.22,24.86 v40.92,25.16 | XIO.33 92.74,10.17 91.59,11.32 75.21,11.32 74.83,10.93 v73.94,10.93 73.56,11.32 50.57,11.32 49.56,10.3 v49.26,10.3
  Bottom 0.203: v40.92,25.16 44.22,25.16 46,23.38 46.63,23.38 48.16,21.86 48.16,10.93 48.79,10.3 v49.26,10.3 | 63.78,27.95 64.72,27.01 64.72,18.32 67.03,16.01
  Bottom 0.254: 63.78,27.95 ICSP.3
  Bottom 0.305: 67.03,16.01 68.86,16.01 v73.94,10.93
PB2  (via drill 0.41)
  Top 0.203: IC3.21 41.26,24.36 41.05,24.14 v39.9,24.14 | XIO.32 97.82,11.44 97.82,9.54 97.18,8.9 92.74,8.9 90.83,10.81 77.5,10.81 76.86,10.17 v75.84,10.17 75.72,10.05 73.69,10.05 72.92,10.81 51.37,10.81 v50.7,10.14
  Bottom 0.203: v39.9,24.14 41.05,24.14 41.68,24.65 44.09,24.65 45.87,22.87 46.38,22.87 47.65,21.6 47.65,10.55 48.79,9.41 49.97,9.41 v50.7,10.14 | ICSP.4 66.45,27.95 67.34,27.06
  Bottom 0.254: 67.34,27.06 67.34,24.78 65.68,23.13 65.68,19.12 67.52,17.28
  Bottom 0.305: 67.52,17.28 69.88,17.28 75.84,11.32 v75.84,10.17
PB3  (via drill 0.41)
  Top 0.203: IC3.22 44.38,23.86 44.6,23.63 v44.6,23 | v81.05,8.78 81.05,9.16 80.04,10.17 77.88,10.17 77.11,9.41 73.56,9.41 72.62,10.35 52.15,10.35 50.44,8.65 v49.05,8.65
  Bottom 0.203: v81.05,8.78 81.18,8.78 82.96,7 89.69,7 91.21,5.47 96.93,5.47 98.07,6.62 98.07,10.55 97.18,11.44 95.28,11.44 XIO.31 | v44.6,23 45.11,23 45.75,22.36 46.13,22.36 47.14,21.35 47.14,10.3 48.79,8.65 v49.05,8.65 | ICSP.1 65,29.15 65,27.39 65.13,27.27 65.13,18.73 65.46,18.4 67.21,16.65
  Bottom 0.254: v81.05,8.78 81.05,9.28 80.54,9.79 78,9.79 77.37,9.16 75.59,9.16 74.96,9.79 74.96,11.19 74.19,11.95 | 69.49,16.65 67.21,16.65
  Bottom 0.305: 74.19,11.95 69.49,16.65
PB4
  Top 0.203: IC3.23 42.93,23.36 42.95,23.38 36.35,23.38 35.23,24.4 35.23,47.64 36.6,48.91 JP6.8
PB5
  Top 0.203: IC3.24 36.11,22.86 34.77,24.14 34.77,48.53 34.06,49.29 JP6.7
PB6
  Top 0.203: IC3.25 42.95,22.36 35.84,22.36 34.32,23.89 34.32,47.64 31.78,50.18 JP6.6
PB7  (via drill 0.41)
  Top 0.203: 35.18,20.23 37.62,20.23 | 37.62,20.23 44.12,20.23 44.25,20.36 IC3.26 | v30.89,40.78 33.17,40.78 33.81,40.14 33.81,23.25 35.18,21.88 35.18,20.23 | 37.62,20.23 37.59,20.21 | IC7.3 20.48,21.6 19.84,21.6 19.46,21.22 19.46,20.21 20.35,19.32 34.44,19.32 35.18,20.05 35.18,20.23
  Bottom 0.254: JP6.5 29.24,49.54 26.7,47 26.7,45.1 28.6,43.19 28.6,43.07 v30.89,40.78
PC0
  Top 0.203: IC3.53 61.52,23.36 62.76,22.11 81.05,22.11 88.16,29.22 95.28,29.22 XIO.18
PC1
  Top 0.203: IC3.54 61.78,23.86 62.89,22.62 80.54,22.62 88.42,30.49 XIO.17
PC2
  Top 0.203: IC3.55 62.04,24.36 63.27,23.13 68.1,23.13 70,25.03 82.07,25.03 88.8,31.76 95.28,31.76 XIO.16
PC3
  Top 0.203: IC3.56 62.3,24.86 63.53,23.63 67.84,23.63 69.75,25.54 81.56,25.54 89.05,33.03 XIO.15
PC4
  Top 0.203: IC3.57 61.87,25.36 63.02,26.49 67.41,26.49 70,29.1 83.85,29.1 89.05,34.3 95.28,34.3 XIO.14
PC5
  Top 0.203: IC3.58 61.69,25.86 62.69,26.87 67.01,26.87 69.88,29.73 83.59,29.73 89.43,35.57 XIO.13
PC6
  Top 0.203: IC3.59 61.55,26.36 62.51,27.32 62.51,28.71 62.81,29.03 68.3,29.03 69.65,30.37 83.21,30.37 89.69,36.84 95.28,36.84 XIO.12
PC7
  Top 0.203: IC3.60 61.42,26.86 62,27.44 62,28.84 62.59,29.41 67.89,29.41 69.34,30.87 82.7,30.87 89.94,38.11 XIO.11
PD7
  Top 0.203: XIO.19 88.04,27.95 81.69,21.6 60.33,21.6 60.33,21.58 59.72,20.97 59.72,20.59 58.19,19.06 58.06,19.06 57.43,18.43 56.92,18.43 56.83,18.52 IC3.50
PE0  (via drill 0.41)
  Top 0.203: PWML.1 63.32,50.81 61.8,49.29 60.48,49.29 59.97,48.78 58.39,48.78 57.33,47.71 49.2,47.71 47.42,45.94 40.72,45.94 39.34,44.56 39.34,40.12 v39.75,39.71 39.75,39.69 39.8,39.69 40.11,39.38 40.11,34.45 40.7,33.86 IC3.2
  Top 0.254: v30.63,37.48 30.56,37.41 30.56,35.76 30.89,35.45 30.89,31.89 29.74,30.75 28.66,30.75 RN4.2
  Bottom 0.305: v30.63,37.48 33.99,37.48 36.25,39.74 39.73,39.74 v39.75,39.71
PE1  (via drill 0.41)
  Top 0.203: IC3.3 39.63,33.36 39.24,33.74 v39.24,38.34 38.89,38.7 38.89,44.77 40.56,46.39 47.02,46.39 48.84,48.22 56.97,48.22 58.04,49.29 59.72,49.29 60.99,50.56 PWML.2
  Top 0.254: RN4.1 29.94,29.93 31.52,31.51 v31.52,36.33
  Bottom 0.305: v31.52,36.33 34.57,36.33 36.65,38.42 39.17,38.42 v39.24,38.34
PE3  (via drill 0.41)
  Top 0.203: IC3.5 39.31,32.36 38.43,33.24 38.43,45 40.41,46.88 44.73,46.88 45.11,47.26 46.63,47.26 v47.27,48.02
  Bottom 0.203: v47.27,48.02 49,48.02 50.83,49.85 PWML.6
PE4
  Top 0.203: IC3.6 38.99,31.86 37.97,32.88 37.97,45.17 40.28,47.38 44.48,47.38 45.49,48.4 46.51,48.4 46.89,48.78 56.67,48.78 58.45,50.56 PWML.3
PE5
  Top 0.203: IC3.7 42.8,31.36 42.57,31.38 38.71,31.38 37.52,32.58 37.52,45.4 40.16,47.89 44.22,47.89 45.24,48.91 46.38,48.91 46.76,49.29 55.78,49.29 55.91,49.42 PWML.4
PG0  (via drill 0.41)
  Top 0.203: IC3.51 58.83,21.86 v59.08,21.48 | XIO.22 95.28,24.14 88.16,24.14 84.1,20.08 71.78,20.08 71.27,19.57 70.38,18.68 70.13,18.43 59.72,18.43 59.46,18.68 v59.08,18.68
  Bottom 0.203: v59.08,18.68 v59.08,21.48
PG1  (via drill 0.41)
  Top 0.203: IC3.52 60.46,22.86 v60.86,22.49 | XIO.21 88.16,25.41 83.34,20.59 71.15,20.59 69.62,19.06 60.35,19.06 59.97,19.44 v59.97,19.57
  Bottom 0.203: v59.97,19.57 60.6,19.57 61.37,20.33 61.37,21.98 v60.86,22.49
PG2  (via drill 0.41)
  Top 0.203: IC3.70 59.82,31.86 59.94,31.74 59.94,29.5 v60.35,29.1 | v60.6,20.71 61.11,20.71 61.49,21.09 82.58,21.09 88.16,26.68 95.28,26.68 XIO.20
  Bottom 0.203: v60.6,20.71 60.22,20.71 59.97,20.97 59.97,28.59 v60.35,29.1
PG5  (via drill 0.41)
  Top 0.203: v61.75,48.42 60.38,48.42 60.22,48.27 58.6,48.27 57.53,47.21 49.4,47.21 47.68,45.48 40.92,45.48 39.8,44.36 39.8,40.96 40.61,40.14 40.61,34.71 40.97,34.35 IC3.1
  Bottom 0.203: PWML.5 53.24,50.81 53.24,50.08 53.37,49.95 53.42,49.95 54.28,49.09 61.09,49.09 v61.75,48.42
PH3
  Top 0.203: IC3.15 37.4,27.36 37.06,27.7 37.06,45.63 40.03,48.4 43.97,48.4 44.98,49.36 46.25,49.36 47.65,50.81 PWML.7
PH4
  Top 0.203: IC3.16 37.19,26.86 36.6,27.44 36.6,45.86 39.9,48.91 43.71,48.91 45.62,50.81 PWML.8
PH5
  Top 0.203: IC3.17 36.93,26.36 36.14,27.14 36.14,46.11 39.65,49.42 41.17,49.42 41.68,49.92 JP6.10
PH6
  Top 0.203: IC3.18 41.86,25.86 41.8,25.92 36.6,25.92 35.69,26.83 35.69,46.82 39.14,50.18 JP6.9
PL0
  Top 0.203: 49.3,20.31 49.3,14.24 51.21,12.33 90.32,12.33 91.97,13.98 95.28,13.98 XIO.30
  Top 0.254: IC3.35 49.33,20.33 49.3,20.31
PL1
  Top 0.203: IC3.36 49.83,14.47 51.46,12.84 89.56,12.84 91.97,15.25 XIO.29
PL2
  Top 0.203: XIO.28 95.28,16.52 92.1,16.52 88.93,13.35 51.97,13.35 50.32,15 50.32,20.31 50.33,20.32 IC3.37
  Top 0.254: IC3.37
PL3
  Top 0.203: IC3.38 50.83,15.51 52.48,13.86 88.29,13.86 92.23,17.79 XIO.27
PL4
  Top 0.203: XIO.26 95.28,19.06 92.35,19.06 87.66,14.36 52.73,14.36 51.33,15.76 51.33,20.23 51.33,20.24 51.33,20.29
  Top 0.254: 51.33,20.29 IC3.39
PL5
  Top 0.203: IC3.40 51.83,16.03 52.98,14.87 87.02,14.87 92.48,20.33 XIO.25
PL6
  Top 0.203: XIO.24 95.28,21.6 92.74,21.6 86.51,15.38 53.49,15.38 52.35,16.52 52.35,20.33 IC3.41
  Top 0.254: 52.33,20.33 IC3.41
PL7
  Top 0.203: IC3.42 52.83,17.06 54,15.89 85.75,15.89 92.74,22.87 XIO.23
PWRIN
  Top 1.016: D1.A 18.31,2.81 17.04,4.08 17.04,4.2 15.39,5.85 15.27,5.85 13.49,7.63 12.4,7.63 X1.2
RD+
  Top 0.254: IC4.29 15.67,34.56 13.54,36.69 13.54,38.01 13.28,38.26 12.8,38.26 RN2.4
RD-
  Top 0.254: RN2.1 13.3,35.87 13.53,35.87 14,35.4 14,35.06 15,34.06 IC4.30
RESET  (via drill 0.41)
  Top 0.254: 46.83,19.46 46.56,19.19 44.22,19.19 43.71,19.7 | 28.82,17.88 28.18,17.88 27.33,17.03 27.33,15.89 RESET-EN.1
  Top 0.279: 46.83,19.46 IC3.30
  Top 0.305: POWER.3 33.05,7.89 v31.52,9.41 | 43.71,19.7 36.22,19.7 35.59,19.06 35.59,18.81 | 28.82,17.88 C7.2 | RESET-EN.1 RESET-EN.2 | RESET-EN.1 27.33,15.38 | 35.59,18.81 D3.A 34.36,16.32 C1.1 | RESET-EN.2 28.73,16.65 30.89,18.81 35.59,18.81 | RESET-EN.1 26.77,15.32 RN5.1 19.13,15.31 | RESET-EN.2 28.73,12.84 v28.09,12.2 | RESET.4 10.43,46.55 2.06,46.55 RESET.3 1.24,45.73 v1.24,43.14
  Top 0.406: v46.88,8.28 47.9,8.27 48.54,7.63 49.56,7.63 49.94,8.01 50.57,8.01 52.45,9.84 72.11,9.84 73.3,8.65 78.51,8.65 v78.64,8.78 | RESET.4 10.49,46.53
  Bottom 0.254: 63.78,25.29 64.29,24.78 64.29,17.79 66.7,15.38
  Bottom 0.305: v78.64,8.78 78.13,8.78 78,8.65 74.96,8.65 68.22,15.38 66.7,15.38 | 63.78,25.29 ICSP.5 | v46.88,8.28 45.75,9.28 31.65,9.28 v31.52,9.41 30.89,9.41 v28.09,12.2 27.99,12.1 1.35,12.1 0.69,12.76 0.69,42.58 v1.24,43.14
RESET2  (via drill 0.41)
  Top 0.254: IC4.24 16.54,38.94 16.54,39.13 | RN5.7 17.41,16.12 v16.54,15.25
  Top 0.305: ICSP1.5 15.01,47.51 | v16.54,15.25 16.61,15.32 | 16.54,39.13 16.54,39.51 v16.22,39.83 16.28,39.76 16.28,41.41 14.38,43.32 12.22,43.32 11.79,43.75 11.79,46.62 D2.A
  Top 0.61: D2.A 13.66,47.51 ICSP1.5
  Bottom 0.305: v16.54,15.25 16.79,15.25 16.79,21.22 19.46,23.76 19.46,29.1 20.6,30.24 23.27,30.24 23.52,30.49 23.52,33.14 18.17,38.49 17.68,38.49 16.47,39.7 v16.22,39.83
RXD1  (via drill 0.41)
  Top 0.203: IC3.45 54.36,20.36 54.34,20.4 54.34,18.36 55.32,17.36 71.98,17.36 v72.67,17.92
  Bottom 0.203: COMMUNICATION.3 81.31,42.68 74.19,35.57 74.19,19.57 v72.67,17.92
RXD2  (via drill 0.41)
  Top 0.203: IC3.12 41.06,28.86 v41.05,28.84
  Bottom 0.203: COMMUNICATION.5 76.23,49.29 75.72,48.78 74.07,48.78 73.69,48.4 68.3,48.4 67.41,49.29 64.62,49.29 63.73,48.4 63.65,48.4 60.73,45.48 58.7,45.48 56.67,47.51 51.33,47.51 50.06,46.24 44.48,46.24 43.71,45.48 43.71,38.98 40.31,35.57 40.31,30.44 41.02,29.73 41.02,28.87 v41.05,28.84
RXD3  (via drill 0.41)
  Top 0.203: COMMUNICATION.7 71.15,49.54 70.89,49.29 68.35,49.29 66.83,47.76 v66.83,47.38 | v55.78,29.73 55.78,29.48 56.92,28.33 58.83,28.33 IC3.63
  Bottom 0.203: v66.83,47.38 66.83,47 55.47,35.52 55.47,33.62 56.16,32.91 56.18,32.91 56.77,32.32 56.77,30.72 v55.78,29.73
RXL
  Top 0.254: 26.3,33.69 25.79,33.69 25.66,33.56 IC4.10
  Top 0.305: 26.3,33.69 RX.C
SCK2
  Top 0.254: ICSP1.3 19.46,48.65 22.25,48.65 23.52,47.38 23.52,39.26 22.89,38.62 22.89,37.86 23.52,37.22 23.52,36.46 23.12,36.06 IC4.15
SCL  (via drill 0.41)
  Top 0.203: IC3.43 53.33,17.32 54.25,16.4 74.7,16.4 75.08,16.78 v75.34,16.9 | v41.45,43.34 v44.96,43.34
  Top 0.254: 80.56,37.24 80.67,37.35 80.67,38.87
  Top 0.305: v81.43,39.13 80.92,39.13 80.67,38.87 | 80.56,37.24 RN1.2
  Bottom 0.203: COMMUNICATION.1 86.39,48.91 85.75,48.91 83.85,47 83.85,43.19 81.43,40.78 v81.43,39.13 80.04,39.13 75.21,34.3 75.21,17.03 v75.34,16.9 74.7,16.27 72.54,16.27 70.76,18.05 70.76,44.59 67.08,48.27 64.92,48.27 61.11,44.46 57.81,44.46 56.03,46.24 51.59,46.24 50.67,45.33 47.57,45.33 45.59,43.34 v44.96,43.34 | JP6.1 18.82,50.3 19.84,49.29 22.25,49.29 25.68,45.86 25.68,43.95 30.25,39.38 31.52,39.38 32.66,40.53 32.66,42.46 34.67,44.46 40.34,44.46 v41.45,43.34
SDA  (via drill 0.41)
  Top 0.203: v74.07,17.67 73.3,16.9 54.51,16.9 53.84,17.6 53.84,20.02 53.82,20.05 53.83,20.16 IC3.44 | v41.45,44.54 v44.96,44.54
  Top 0.305: v78.77,39 78.77,36.84 79.15,36.46 79.98,36.46 RN1.3
  Bottom 0.203: COMMUNICATION.2 83.85,49.54 82.58,48.27 82.58,42.81 v78.77,39 74.7,34.94 74.7,18.94 74.07,18.3 v74.07,17.67 74.07,17.03 73.81,16.78 72.67,16.78 71.27,18.17 71.27,44.72 67.21,48.78 64.8,48.78 60.99,44.97 58.32,44.97 56.41,46.88 51.46,46.88 50.37,45.78 46.89,45.78 45.64,44.54 v44.96,44.54 | JP6.2 21.49,50.81 26.19,46.11 26.19,44.21 30.51,39.89 31.27,39.89 32.16,40.78 32.16,42.68 34.52,45.05 40.94,45.05 v41.45,44.54
TXD1  (via drill 0.41)
  Top 0.203: IC3.46 54.83,20.27 54.84,20.27 54.84,18.75 55.65,17.92 70.76,17.92 v72.03,19.19
  Bottom 0.203: COMMUNICATION.4 78.77,42.56 73.69,37.48 73.69,20.08 72.67,19.19 v72.03,19.19
TXD2  (via drill 0.41)
  Top 0.203: IC3.13 41.83,28.36 41.43,27.95 39.9,27.95 39.78,28.08 v39.78,28.84
  Bottom 0.203: 39.78,29.22 v39.78,28.84 39.78,35.85 43.21,39.28 43.21,45.94 43.97,46.7 49.76,46.7 51.08,48.02 57.05,48.02 59.08,45.99 60.6,45.99 63.53,48.91 63.65,48.91 64.54,49.8 67.49,49.8 68.38,48.91 73.18,48.91 73.69,49.54 COMMUNICATION.6
TXD3  (via drill 0.41)
  Top 0.203: COMMUNICATION.8 68.35,50.81 67.72,50.18 67.72,49.8 v65.3,47.38 | IC3.64 58.68,28.86 58.57,28.84 57.68,28.84 57.3,29.22 57.3,30.37 v55.78,31.89
  Bottom 0.203: v65.3,47.38 65.3,46.24 54.99,35.9 54.99,32.68 v55.78,31.89
TXL
  Top 0.254: TX.C 26.82,36.84 24.04,34.06 IC4.11
UGND
  Top 0.254: IC4.28 16.23,35.06 15.67,35.62
  Top 0.406: 15.67,35.62 14.61,36.69 14.61,37.07 C10.2
  Top 0.813: X2.4 6.53,36.84 5.11,36.84 4.47,37.48 4.47,40.53 7.59,43.65 7.65,43.65 8.61,44.61 10.29,44.61 10.85,44.06 10.85,44.01 10.95,43.9 10.95,43.4 12.07,42.33 12.28,42.33 L1.1 13.94,41.52 14.55,40.91 14.55,37.33 C10.2
  Bottom 0.813: X2.4 6.55,36.55 GROUND.1
USBVCC
  Top 0.254: IC4.31 15.92,33.56 15.14,32.78 15.14,32.02 14.38,31.25
  Top 0.305: 14.38,31.25 13.23,31.25 C8.1
  Top 0.406: C8.1 12.98,31.51 12.34,32.14 10.82,32.14 10.19,31.51 10.19,28.59 11.58,27.19 11.58,25.9
  Top 0.61: 11.58,25.9 T1.1 6.99,24.73 F1.1
USHIELD  (via drill 0.41)
  Top 0.406: L1.2 10.89,41.36
  Top 0.813: X2.P$2 3.84,33.03 5.11,33.03 5.74,33.67 9.82,33.67 Z1.1 | v9.68,43.19 9.68,41.92 10.08,41.52 L1.2 11.09,41.31 Z2.1 | X2.P$1 4.64,44.92
  Bottom 0.813: v9.68,43.19 5.01,43.19 X2.P$1
  Bottom 1.27: X2.P$2 3.84,33.03 2.13,34.73 2.13,41.44 3.84,43.19 X2.P$1
VIN  (via drill 0.41)
  Top 0.203: 11.79,20.07 IC1.3
  Top 0.305: RN5.6 16.01,16.92 15.77,17.16
  Top 0.813: v24.03,7.38 22.62,7.38 PC1.+ 17.06,11.56 15.27,13.35 15.27,15.76 15.77,16.27 15.77,17.16 C2.1 12.86,20.07 11.79,20.07
  Top 1.016: D1.C 24.03,3.02 v24.03,7.38
  Bottom 1.27: v24.03,7.38 24.54,7.76 24.92,7.38 44.35,7.38 45.75,5.98 POWER.8
VUCAP
  Top 0.254: IC4.27 16.85,35.56 16.59,35.83
  Top 0.406: 16.59,35.83 16.28,36.13 16.28,37.17 C10.1
XT1
  Top 0.254: 17.83,29.35 R2.1 18.21,30.01 IC4.1
  Top 0.305: C14.1 16.15,26.3 Y2.2
  Top 0.406: C14.1 R2.1
XT2
  Top 0.254: IC4.2 18.71,29.96 R2.2 | C15.1 20.73,26.3 Y2.1
  Top 0.406: C15.1 R2.2
XTAL1
  Top 0.203: IC3.34 48.83,18.81 47.56,17.54 42.57,17.54
  Top 0.254: Y1.3 39.92,13.62 R1.1 40.92,13.73 41.68,14.49 41.68,16.9 42.32,17.54 42.57,17.54
XTAL2
  Top 0.203: 43.33,18.05 43.43,17.94 47.08,17.94 48.33,19.19 IC3.33
  Top 0.254: 37.86,15.62 Y1.1 37.98,15.62 38.09,15.51 R1.2 41.05,16.01 41.05,17.16 41.94,18.05 43.33,18.05
XVCC
  Top 0.61: F1.2 2.52,28.63 1.55,29.6 1.55,34.05 2.44,34.94 7.47,34.94 8.56,36.03 8.56,36.85 X2.1

## Text on the board
Bottom: Mega2560 Rev3E
tPlace: 9 | 8 | 7 | 6 | 5 | 4 | 3 | 2 | 1 | 0 | 22 | 14 | 15 | 16 | 17 | 18 | 19 | 20 | 21 | 13 | 12 | 11 | 10 | 24 | 26 | 28 | 30 | 31 | 32 | 33 | 34 | 35 | 36 | 37 | 38 | 39 | 40 | 41 | 42 | 43 | Arduino.org | 44 | 45 | 46 | 47 | TM | 48 | 49 | 50 | 51 | 52 | 53 | 0 | 1 | 2 | 3 | 4 | 5 | 6 | 7 | 8 | 9 | 10 | 11 | 12 | 13 | 14 | 15
tNames: SCL | SDA | 5V | GND | AREF | PWM | TX | RX | TX3 | RX3 | TX2 | RX2 | TX1 | RX1 | SDA | SCL | MADE IN | 1 | ITALY | DIGITAL | Arduino | MEGA 2560 | PC1 | PC2 | ANALOG IN | GND | IOREF | RESET | 3V3 | 5V | GND | VIN
bNames: MADE IN | designed by | ITALY | tinker it
ReferenceLC: L | ON | TX | RX
test-probe: SCL | SDA | AREF | GND3 | 13 | 12 | 11 | 10 | 9 | 8 | 7 | 6 | 5 | 4 | 3 | 2 | 1 | 0 | 14 | 15 | 16 | 17 | 18 | 19 | 20 | 21 | 5V_2 | 5V_3 | 22 | 23 | 24 | 25 | ISP2_6 | ISP2_4 | ISP2_2 | ISP2_1 | ISP2_3 | ISP2_5 | 26 | 27 | USB1_D+ | USB1_D- | 28 | 29 | 30 | 31 | USB1_GND | USB1_5V+ | 32 | 33 | 34 | 35 | ISP1_1 | ISP1_2 | 36 | 37 | ISP1_3 | ISP1_4 | 38 | 39 | ISP1_5 | ISP1_6 | 40 | 41 | 42 | 43 | 44 | 45 | 46 | 47 | 48 | 49 | 50 | 51 | DC_Vin- | DC_Vin+ | 52 | 53 | GND4 | GND5 | IOREF | RESET | 3V3 | 5V_1 | GND1 | GND2 | VIN | A0 | A1 | A2 | A3 | A4 | A5 | A6 | A7 | A8 | A9 | A10 | A11 | A12 | A13 | A14 | A15